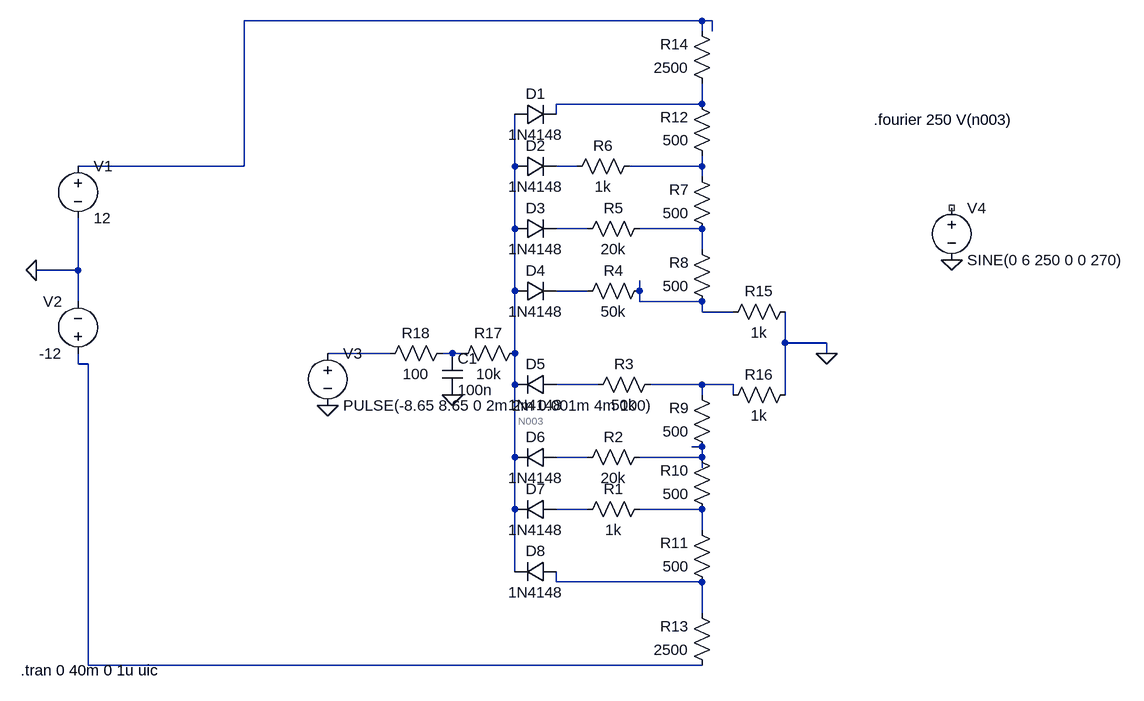
[diagram p0: schematic metodo_ruptura.asc]
metodo_ruptura.asc, the LTspice schematic file:
Version 4
SHEET 1 1200 908
WIRE 528 -112 -176 -112
WIRE 544 -112 528 -112
WIRE 528 -96 528 -112
WIRE 544 -96 544 -112
WIRE 528 16 528 -16
WIRE 528 16 304 16
WIRE 304 32 304 16
WIRE -176 112 -176 -112
WIRE -176 112 -432 112
WIRE 240 112 240 32
WIRE 336 112 304 112
WIRE 528 112 528 96
WIRE 528 112 416 112
WIRE 528 128 528 112
WIRE 240 208 240 112
WIRE 352 208 304 208
WIRE 528 208 432 208
WIRE 528 240 528 208
WIRE -432 272 -432 192
WIRE -432 272 -496 272
WIRE 240 304 240 208
WIRE 352 304 304 304
WIRE 432 304 432 288
WIRE -432 320 -432 272
WIRE 432 320 432 304
WIRE 528 320 432 320
WIRE 528 336 528 320
WIRE 576 336 528 336
WIRE 656 384 656 336
WIRE 720 384 656 384
WIRE 48 400 -48 400
WIRE 144 400 128 400
WIRE 160 400 144 400
WIRE 240 400 240 304
WIRE 720 400 720 384
WIRE -432 416 -432 400
WIRE -416 416 -432 416
WIRE 240 448 240 400
WIRE 368 448 304 448
WIRE 528 448 448 448
WIRE 576 448 528 448
WIRE 528 464 528 448
WIRE 576 464 576 448
WIRE 656 464 656 384
WIRE 528 544 512 544
WIRE 240 560 240 448
WIRE 352 560 304 560
WIRE 528 560 528 544
WIRE 528 560 432 560
WIRE 528 576 528 560
WIRE 240 640 240 560
WIRE 352 640 304 640
WIRE 528 640 432 640
WIRE 528 672 528 640
WIRE 240 736 240 640
WIRE 304 752 304 736
WIRE 528 752 304 752
WIRE 528 800 528 752
WIRE -416 880 -416 416
WIRE 528 880 -416 880
FLAG 720 400 0
FLAG -496 272 0
FLAG -48 480 0
FLAG 912 256 0
FLAG 144 464 0
SYMBOL diode 240 48 R270
WINDOW 0 32 32 VTop 2
WINDOW 3 0 32 VBottom 2
SYMATTR InstName D1
SYMATTR Value 1N4148
SYMBOL diode 240 128 R270
WINDOW 0 32 32 VTop 2
WINDOW 3 0 32 VBottom 2
SYMATTR InstName D2
SYMATTR Value 1N4148
SYMBOL diode 240 224 R270
WINDOW 0 32 32 VTop 2
WINDOW 3 0 32 VBottom 2
SYMATTR InstName D3
SYMATTR Value 1N4148
SYMBOL diode 240 320 R270
WINDOW 0 32 32 VTop 2
WINDOW 3 0 32 VBottom 2
SYMATTR InstName D4
SYMATTR Value 1N4148
SYMBOL diode 304 432 R90
WINDOW 0 0 32 VBottom 2
WINDOW 3 32 32 VTop 2
SYMATTR InstName D5
SYMATTR Value 1N4148
SYMBOL diode 304 544 R90
WINDOW 0 0 32 VBottom 2
WINDOW 3 32 32 VTop 2
SYMATTR InstName D6
SYMATTR Value 1N4148
SYMBOL diode 304 624 R90
WINDOW 0 0 32 VBottom 2
WINDOW 3 32 32 VTop 2
SYMATTR InstName D7
SYMATTR Value 1N4148
SYMBOL diode 304 720 R90
WINDOW 0 0 32 VBottom 2
WINDOW 3 32 32 VTop 2
SYMATTR InstName D8
SYMATTR Value 1N4148
SYMBOL res 448 624 R90
WINDOW 0 0 56 VBottom 2
WINDOW 3 32 56 VTop 2
SYMATTR InstName R1
SYMATTR Value 1k
SYMBOL res 448 544 R90
WINDOW 0 0 56 VBottom 2
WINDOW 3 32 56 VTop 2
SYMATTR InstName R2
SYMATTR Value 20k
SYMBOL res 464 432 R90
WINDOW 0 0 56 VBottom 2
WINDOW 3 32 56 VTop 2
SYMATTR InstName R3
SYMATTR Value 50k
SYMBOL res 448 288 R90
WINDOW 0 0 56 VBottom 2
WINDOW 3 32 56 VTop 2
SYMATTR InstName R4
SYMATTR Value 50k
SYMBOL res 448 192 R90
WINDOW 0 0 56 VBottom 2
WINDOW 3 32 56 VTop 2
SYMATTR InstName R5
SYMATTR Value 20k
SYMBOL res 432 96 R90
WINDOW 0 0 56 VBottom 2
WINDOW 3 32 56 VTop 2
SYMATTR InstName R6
SYMATTR Value 1k
SYMBOL res 544 224 R180
WINDOW 0 36 76 Left 2
WINDOW 3 36 40 Left 2
SYMATTR InstName R7
SYMATTR Value 500
SYMBOL res 544 336 R180
WINDOW 0 36 76 Left 2
WINDOW 3 36 40 Left 2
SYMATTR InstName R8
SYMATTR Value 500
SYMBOL res 544 560 R180
WINDOW 0 36 76 Left 2
WINDOW 3 36 40 Left 2
SYMATTR InstName R9
SYMATTR Value 500
SYMBOL res 544 656 R180
WINDOW 0 36 76 Left 2
WINDOW 3 36 40 Left 2
SYMATTR InstName R10
SYMATTR Value 500
SYMBOL res 544 768 R180
WINDOW 0 36 76 Left 2
WINDOW 3 36 40 Left 2
SYMATTR InstName R11
SYMATTR Value 500
SYMBOL res 544 112 R180
WINDOW 0 36 76 Left 2
WINDOW 3 36 40 Left 2
SYMATTR InstName R12
SYMATTR Value 500
SYMBOL res 544 896 R180
WINDOW 0 36 76 Left 2
WINDOW 3 36 40 Left 2
SYMATTR InstName R13
SYMATTR Value 2500
SYMBOL res 544 0 R180
WINDOW 0 36 76 Left 2
WINDOW 3 36 40 Left 2
SYMATTR InstName R14
SYMATTR Value 2500
SYMBOL res 672 320 R90
WINDOW 0 0 56 VBottom 2
WINDOW 3 32 56 VTop 2
SYMATTR InstName R15
SYMATTR Value 1k
SYMBOL res 672 448 R90
WINDOW 0 0 56 VBottom 2
WINDOW 3 32 56 VTop 2
SYMATTR InstName R16
SYMATTR Value 1k
SYMBOL voltage -432 96 R0
WINDOW 123 0 0 Left 0
WINDOW 39 0 0 Left 0
SYMATTR InstName V1
SYMATTR Value 12
SYMBOL voltage -432 416 R180
WINDOW 0 24 96 Left 2
WINDOW 3 24 16 Left 2
WINDOW 123 0 0 Left 0
WINDOW 39 0 0 Left 0
SYMATTR InstName V2
SYMATTR Value -12
SYMBOL voltage -48 384 R0
WINDOW 123 0 0 Left 0
WINDOW 39 0 0 Left 0
SYMATTR InstName V3
SYMATTR Value PULSE(-8.65 8.65 0 2m 2m 0.001m 4m 100)
SYMBOL voltage 912 160 R0
WINDOW 123 0 0 Left 0
WINDOW 39 0 0 Left 0
SYMATTR InstName V4
SYMATTR Value SINE(0 6 250 0 0 270)
SYMBOL res 256 384 R90
WINDOW 0 0 56 VBottom 2
WINDOW 3 32 56 VTop 2
SYMATTR InstName R17
SYMATTR Value 10k
SYMBOL res 144 384 R90
WINDOW 0 0 56 VBottom 2
WINDOW 3 32 56 VTop 2
SYMATTR InstName R18
SYMATTR Value 100
SYMBOL cap 128 400 R0
SYMATTR InstName C1
SYMATTR Value 100n
TEXT -520 888 Left 2 !.tran 0 40m 0 1u uic
TEXT 792 40 Left 2 !.fourier 250 V(n003)

The netlist it stands for:
* metodo_ruptura.asc
D1 N003 N002 1N4148
D2 N003 N004 1N4148
D3 N003 N006 1N4148
D4 N003 N008 1N4148
D5 N013 N003 1N4148
D6 N016 N003 1N4148
D7 N017 N003 1N4148
D8 N019 N003 1N4148
R1 N018 N017 1k
R2 N015 N016 20k
R3 N014 N013 50k
R4 N009 N008 50k
R5 N007 N006 20k
R6 N005 N004 1k
R7 N007 N005 500
R8 N009 N007 500
R9 N015 N014 500
R10 N018 N015 500
R11 N019 N018 500
R12 N005 N002 500
R13 N012 N019 2500
R14 N002 N001 2500
R15 0 N009 1k
R16 0 N014 1k
V1 N001 0 12
V2 N012 0 -12
V3 N010 0 PULSE(-8.65 8.65 0 2m 2m 0.001m 4m 100)
V4 NC_01 0 SINE(0 6 250 0 0 270)
R17 N003 N011 10k
R18 N011 N010 100
C1 N011 0 100n
.model D D
.lib standard.dio
.tran 0 40m 0 1u uic
.fourier 250 V(n003)
.backanno
.end